# EasyEDA schematic auto-light-LGT8F328P.easyeda.json
TITLE: Sheet_1; REV: 1.0; Date: 2022-06-24; Sheet: 1/1; Drawn By: xuancong84; Company: Your Company
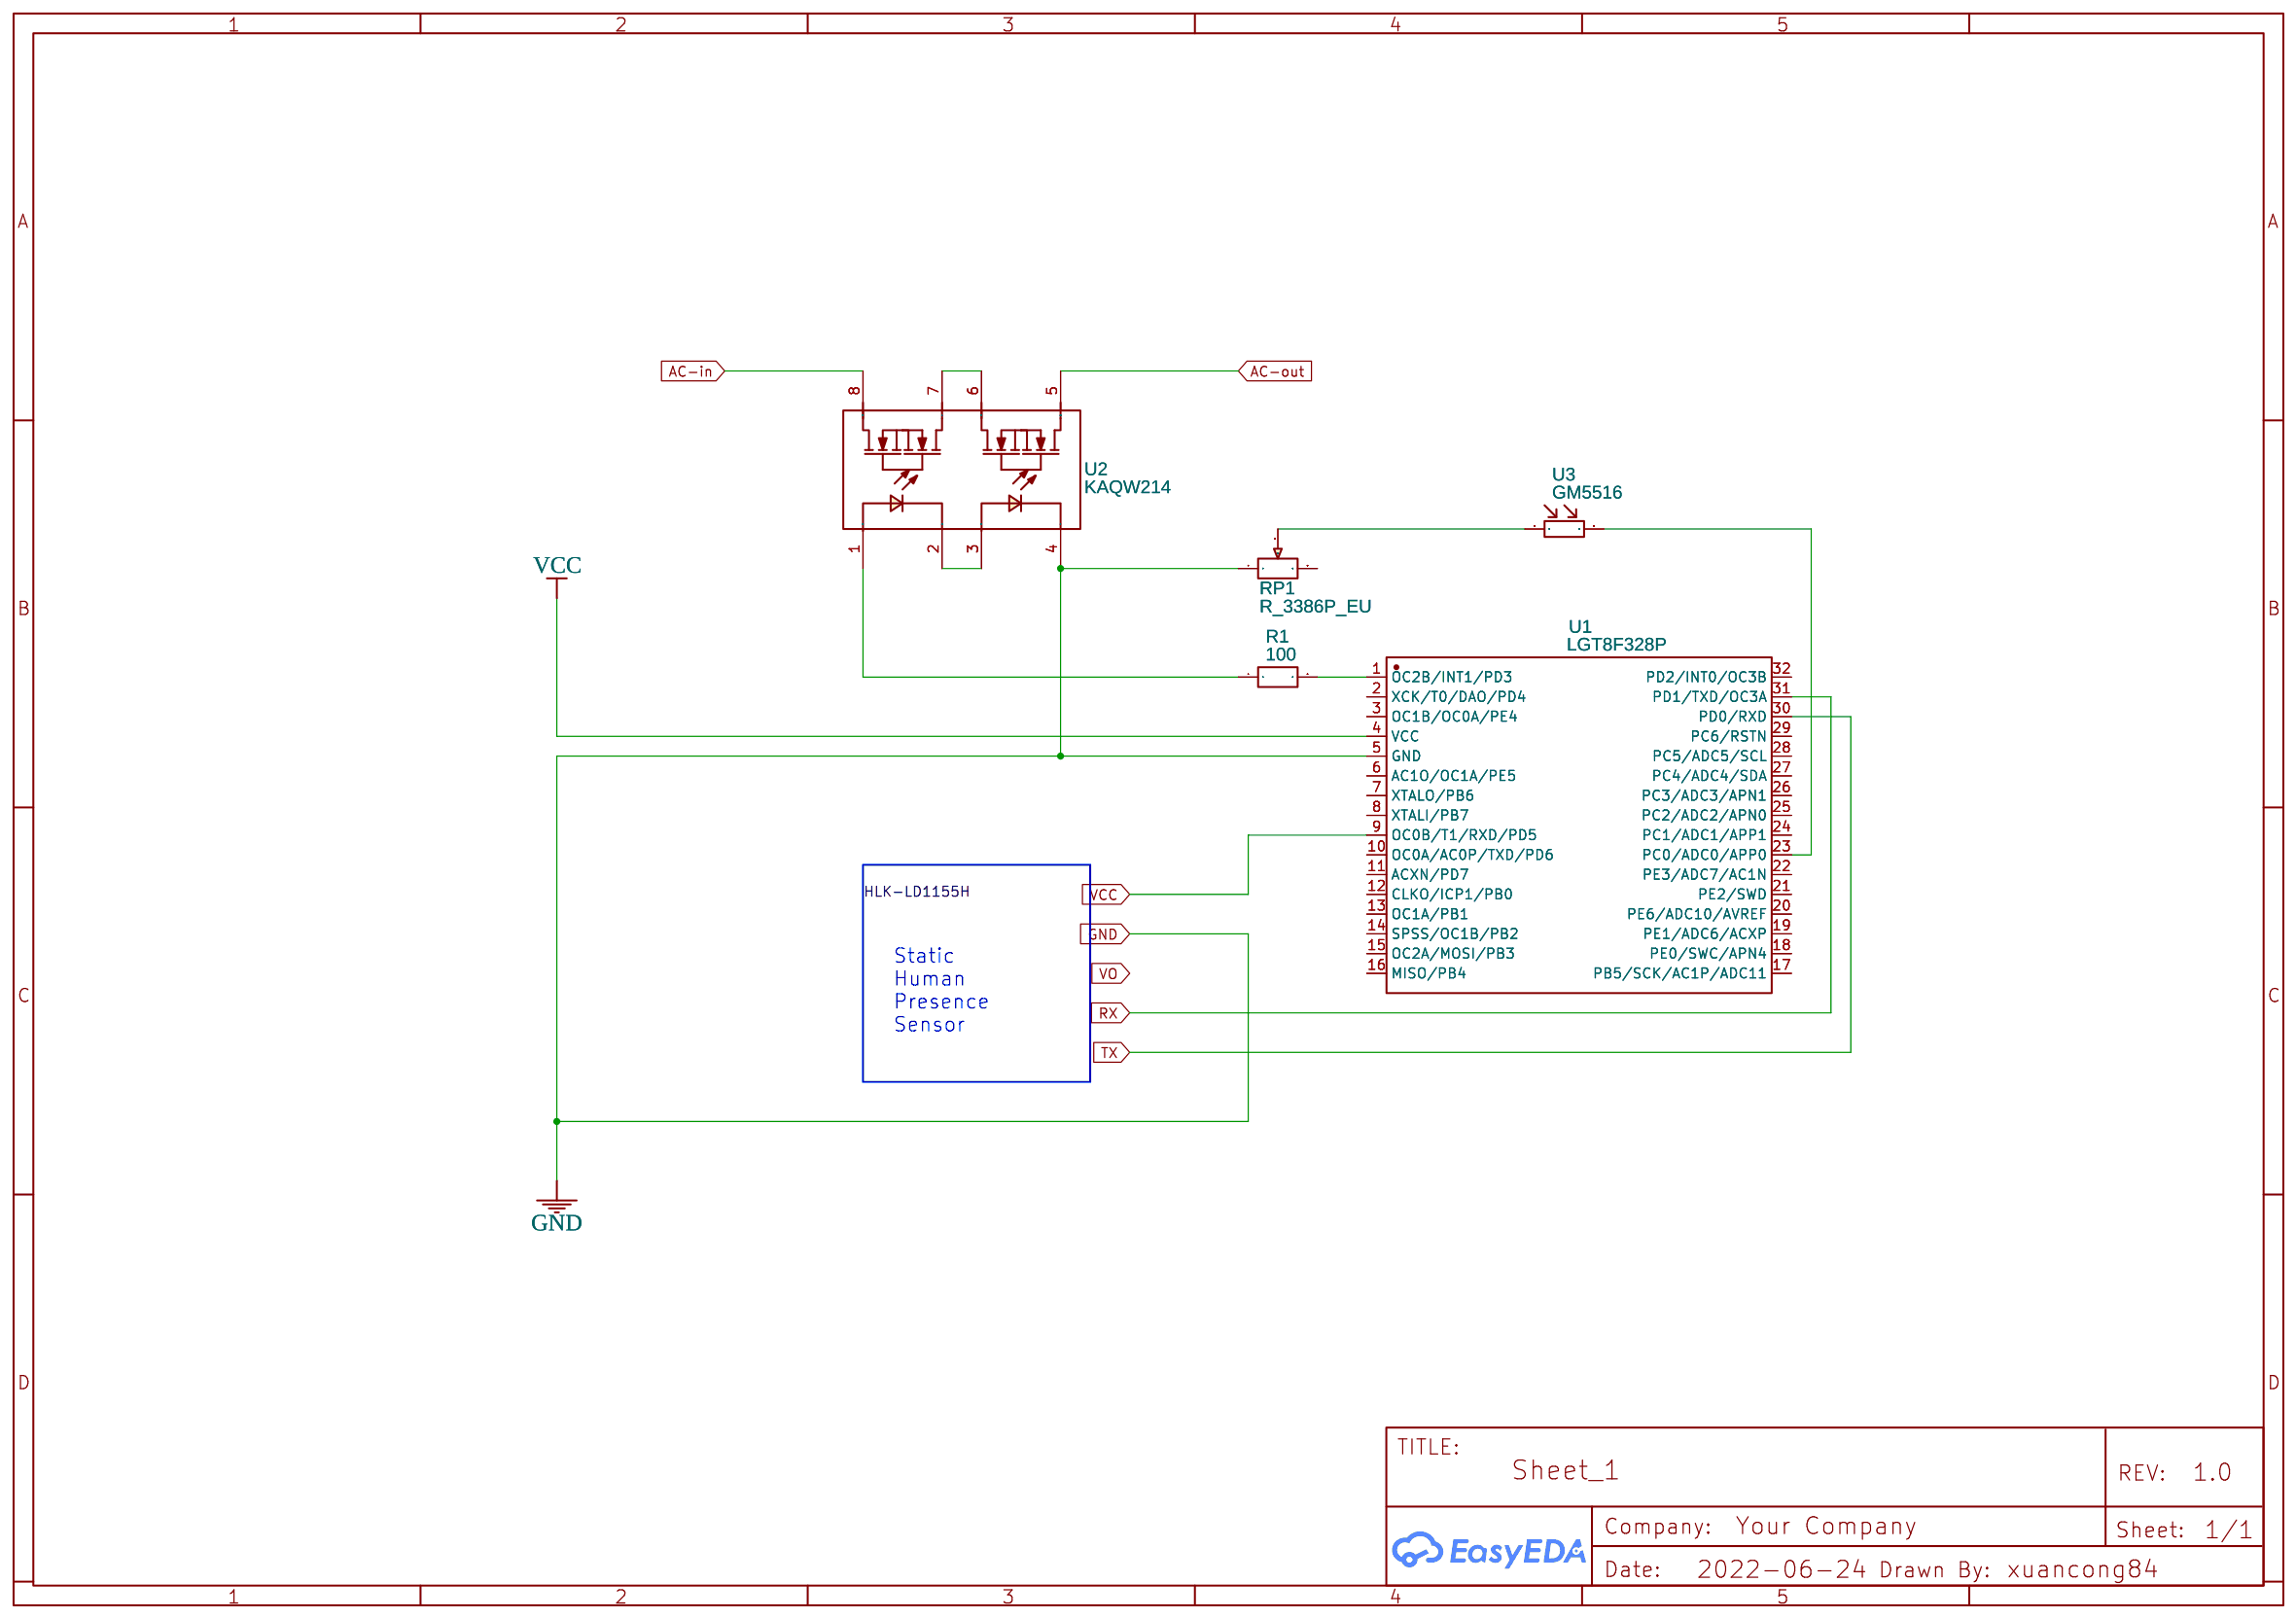
[diagram p0: schematic sheet]

## Parts
R1  100  [R0603]
RP1  R_3386P_EU  [RES-ADJ-TH_3386P]
U1  LGT8F328P  [LQFP-32_L7.0-W7.0-P0.80-LS9.0-BL]
U2  KAQW214  [DIP-8_L9.9-W6.5-P2.54-LS7.6-BL]
U3  GM5516  [RES-TH_L5.1-W4.3-P3.40-D0.5]

## Library data of the parts
R1 = R_0603_EU: Contributor: LCEDA_Lib
RP1 = R_3386P_EU: Supplier: LCSC; Contributor: LCEDA_Lib; Value(Ω): 10K
U1 = LGT8F328P: Supplier: LCSC; Supplier Part: C910803; Manufacturer: null; Contributor: LCSC; JLCPCB Part Class: Extended Part
U2 = KAQW214: Supplier: LCSC; Supplier Part: C194714; Manufacturer: Cosmo Electronics; Contributor: LCSC; JLCPCB Part Class: Extended Part
U3 = GM5516: Supplier: LCSC; Supplier Part: C2844193; Manufacturer: null; JLCPCB Part Class: Extended Part; Contributor: LCSC

## Nets
GND: RP1.1 U1.5(GND) U2.4
VCC: U1.4(VCC) U1.9(OC0B/T1/RXD/PD5)
AC-in: U2.8
AC-out: U2.5
RX: U1.31(PD1/TXD/OC3A)
TX: U1.30(PD0/RXD)
Net-(R1-1): R1.1 U2.1
Net-(R1-2): R1.2 U1.1(OC2B/INT1/PD3)
Net-(RP1-2): RP1.2 U3.1
Net-(U1-23): U1.23(PC0/ADC0/APP0) U3.2
Net-(U2-2): U2.2 U2.3
Net-(U2-6): U2.6 U2.7

Not connected (* = marked no-connect by the designer): RP1 3; U1 2(XCK/T0/DAO/PD4) 3(OC1B/OC0A/PE4) 6(AC1O/OC1A/PE5) 7(XTALO/PB6) 8(XTALI/PB7) 10(OC0A/AC0P/TXD/PD6) 11(ACXN/PD7) 12(CLKO/ICP1/PB0) 13(OC1A/PB1) 14(SPSS/OC1B/PB2) 15(OC2A/MOSI/PB3) 16(MISO/PB4) 17(PB5/SCK/AC1P/ADC11) 18(PE0/SWC/APN4) 19(PE1/ADC6/ACXP) 20(PE6/ADC10/AVREF) 21(PE2/SWD) 22(PE3/ADC7/AC1N) 24(PC1/ADC1/APP1) 25(PC2/ADC2/APN0) 26(PC3/ADC3/APN1) 27(PC4/ADC4/SDA) 28(PC5/ADC5/SCL) 29(PC6/RSTN) 32(PD2/INT0/OC3B)

## Notes on the sheet
- Static
  Human
  Presence
  Sensor
